# EAGLE design Adafruit_MCP7386x (EAGLE 5.01)
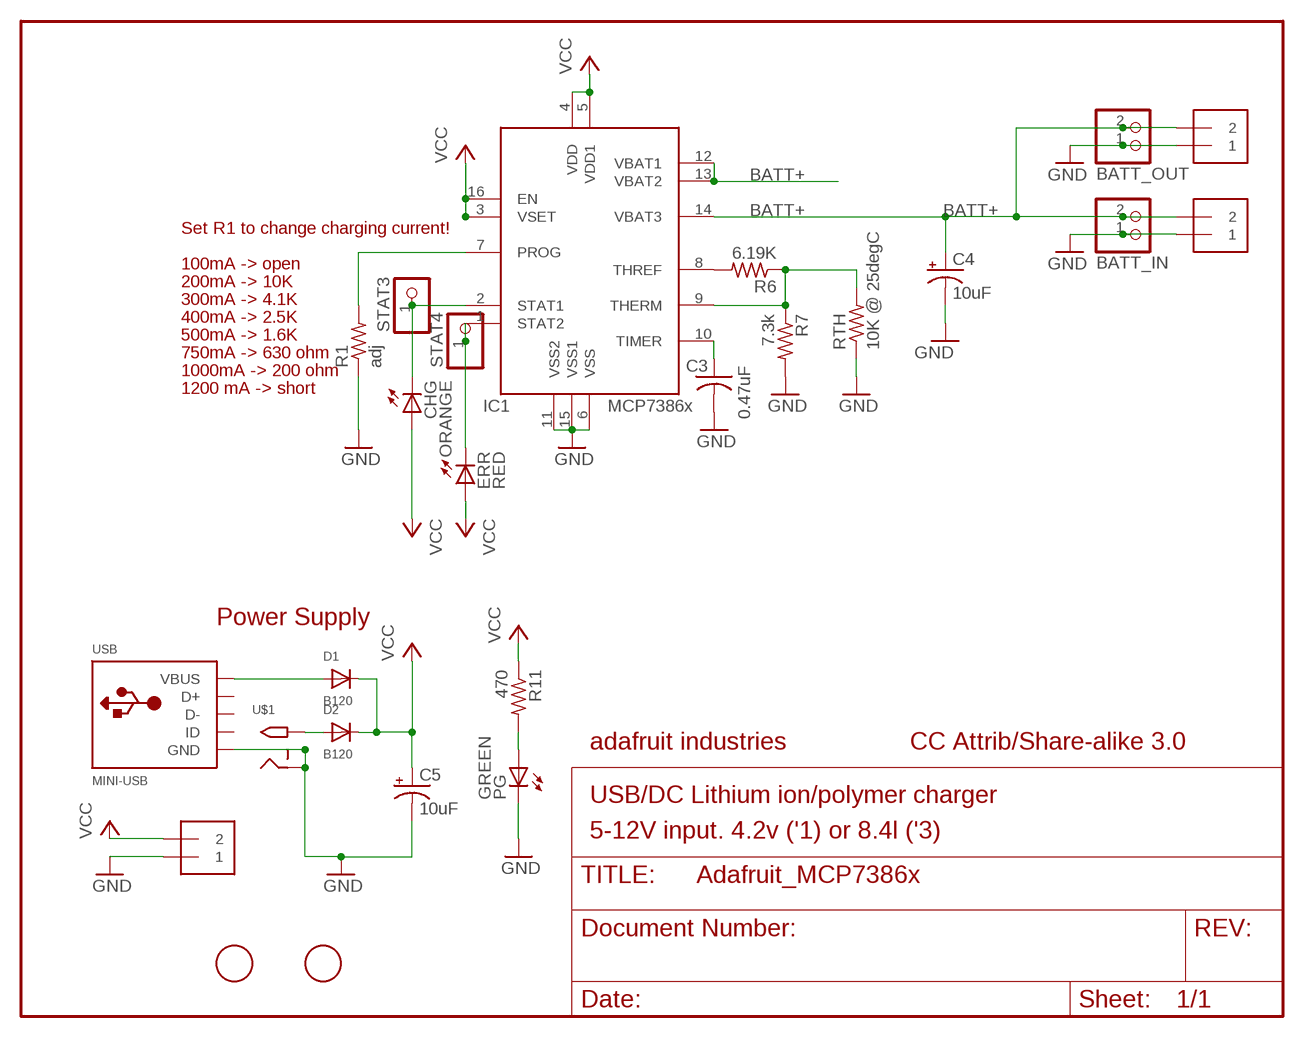
[diagram p0: schematic, sheet 1]

## Parts
BATT_IN  JST_2PIN  [JSTPH2]
BATT_OUT  JST_2PIN  [JSTPH2]
C3  0.47uF  C-USC0805K  [C0805K]
C4  10uF  CPOL-USA/3216-18R  [A/3216-18R]
C5  10uF  CPOL-USA/3216-18R  [A/3216-18R]
CHG  ORANGE  LEDCHIPLED_0805  [CHIPLED_0805]
D1  B120  DIODESMA  [SMADIODE]
D2  B120  DIODESMA  [SMADIODE]
ERR  RED  LEDCHIPLED_0805  [CHIPLED_0805]
IC1  MCP7386XS  [SO16]
IN  1X2-3.5MM  [3.5MMTERM]
OUT  1X2-3.5MM  [3.5MMTERM]
PG  GREEN  LEDCHIPLED_0805  [CHIPLED_0805]
R1  adj  R-US_FLIPFLOP  [0805-THM]
R6  6.19K  R-US_R0805  [R0805]
R7  7.3k  R-US_R0805  [R0805]
R11  470  R-US_R0805  [R0805]
RTH  10K @ 25degC  R-US_FLIPFLOP  [0805-THM]
STAT3  PINHD-1X1  [1X01]
STAT4  PINHD-1X1  [1X01]
U$1  2.1MMJACKSMT  [DCJACK_2MM_SMT]
U$3  FIDUCIAL  [FIDUCIAL_1MM]
U$4  FIDUCIAL  [FIDUCIAL_1MM]
USB  MINI-USB  USBMINIB  [USB-MINIB]
VIN  1X2-3.5MM  [3.5MMTERM]

## Nets
BATT+: BATT_IN.2 BATT_OUT.2 C4.+ IC1.12(VBAT1) IC1.13(VBAT2) IC1.14(VBAT3) IN.2 OUT.2
GND: BATT_IN.1 BATT_OUT.1 C3.2 C4.- C5.- IC1.6(VSS) IC1.11(VSS2) IC1.15(VSS1) IN.1 OUT.1 PG.C R1.1 R7.2 RTH.1 U$1.GND(RING) U$1.GNDBREAK(RING_SW) USB.GND VIN.1
N$4: D1.A USB.VBUS
N$5: IC1.7(PROG) R1.2
N$7: CHG.C IC1.2(STAT1) STAT3.1
N$8: ERR.C IC1.1(STAT2) STAT4.1
N$9: C3.1 IC1.10(TIMER)
N$10: IC1.8(THREF) R6.2
N$11: IC1.9(THERM) R6.1 R7.1 RTH.2
N$16: PG.A R11.2
N$17: D2.A U$1.PWR2(TIP)
VCC: C5.+ CHG.A D1.C D2.C ERR.A IC1.3(VSET) IC1.4(VDD) IC1.5(VDD1) IC1.16(EN) R11.1 VIN.2
Unconnected: USB.D+ USB.D- USB.ID

## Notes on the sheet
- Set R1 to change charging current!
- 100mA -> open
- 200mA -> 10K
- 300mA -> 4.1K
- 400mA -> 2.5K
- 500mA -> 1.6K
- 750mA -> 630 ohm
- 1000mA -> 200 ohm
- 1200 mA -> short
- Power Supply
- adafruit industries | CC Attrib/Share-alike 3.0
- USB/DC Lithium ion/polymer charger
- 5-12V input. 4.2v ('1) or 8.4l ('3)

## Library data of the parts
BATT_IN BATT_OUT = microbuilder:JST_2PIN: JST 2-Pin Right-Angle Connector 4UConnector: 17311
C3 = adafruit:C-US: CAPACITOR, American symbol
C4 C5 = adafruit:CPOL-US: POLARIZED CAPACITOR, American symbol
CHG ERR PG = adafruit:LED: LED OSRAM: - CHIPLED LG R971, LG N971, LY N971, LG Q971, LY Q971, LO R971, LY R971 LH N974, LH R974 LS Q976, LO Q976, LY Q976 LO Q996 - Hyper CHIPLED LW Q18S LB Q993, LB Q99A, LB R99A - SideLED LS A670, LO A670, LY A670, LG A670, LP A670 LB A673, LV A673, LT A673, LW A673 LH A674 LY A675 LS A676, LA A676, LO A676, LY A676, LW A676 LS A679, LY A679, LG A679 - Hyper Micro SIDELED® LS Y876, LA Y876, LO Y876, LY Y876 LT Y87S - SmartLED LW L88C, LW L88S LB L89C, LB L89S, LG L890 LS L89K, LO L89K, LY L89K LS L896, LA L896, LO L896, LY L896 - TOPLED LS T670, LO T670, LY T670, LG T670, LP T670 LSG T670, LSP T670, LSY T670, LOP T670, LYG T670 LG T671, LOG T671, LSG T671 LB T673, LV T673, LT T673, LW T673 LH T674 LS T676, LA T676, LO T676, LY T676, LB T676, LH T676, LSB T676, LW T676 LB T67C, LV T67C, LT T67C, LS T67K, LO T67K, LY T67K, LW E67C LS E67B, LA E67B, LO E67B, LY E67B, LB E67C, LV E67C, LT E67C LW T67C LS T679, LY T679, LG T679 LS T770, LO T770, LY T770, LG T770, LP T770 LB T773, LV T773, LT T773, LW T773 LH T774 LS E675, LA E675, LY E675, LS T675 LS T776, LA T776, LO T776, LY T776, LB T776 LHGB T686 LT T68C, LB T68C - Hyper Mini TOPLED® LB M676 - Mini TOPLED Santana® LG M470 LS M47K, LO M47K, LY M47K Source: http://www.osram.convergy.de/
D1 D2 = microbuilder:DIODE: Diode SMADIODE - SMA Surface Mount Package 20V 1A Schottky Diode Digikey: 641-1014-6-ND DO-1N4148 - Through Hole Small Current Diode SOD-323 10V 570mA (.38mV Vf, 3ns) Schottky Diode - Digikey: ZLLS410CT-ND SOD-523 30V 30mA Schottky Diode (RB751S-40TE61) - Digikey: RB751S-40TE61CT-ND SOT23-R/W - SOT23 Package (R = Solder Paste/Reflow Ovens, W = Hand-Soldering) BAT54Film 40V 300mA - Digikey: 497-7162-1-ND
IC1 = adafruit:MCP7386X: MCP7386x 4.1, 4.2, 8.2, 8.4 LiPoly battery charger chip family, with wide DC input, thermal cutoff, adjustable curret, and indicator LEDs
IN OUT VIN = adafruit:1X2: 3.5mm Terminal block http://www.ladyada.net/library/pcb/eaglelibrary.html
R1 R6 R7 R11 RTH = adafruit:R-US_: RESISTOR, American symbol
STAT3 STAT4 = adafruit:PINHD-1X1: Pin header 1x1 for 0.1" spacing With round pins
U$1 = adafruit:2.1MMJACK: 2.1mm x 5.5mm THM DC jack with internal switch. Digikey part #PJ-102A, 4UCON part #05537 2.1mm x 5.5mm SMT DC jack with internal switch. Digikey part #PJ-002A-SMT, 4UCON part #03267 By microbuilder.eu & adafruit.com
U$3 U$4 = adafruit:FIDUCIAL: For use by pick and place machines to calibrate the vision/machine, 1mm By microbuilder.eu
USB = adafruit:USB: USB Connectors USBMINIB - Surface Mount Female Mini-B USB Connector 4UConnector: 06564 By microbuilder.eu Thru-hole RA Female Mini-B USB Connector 4UConnector: 18732 By ladyada.net

## Board
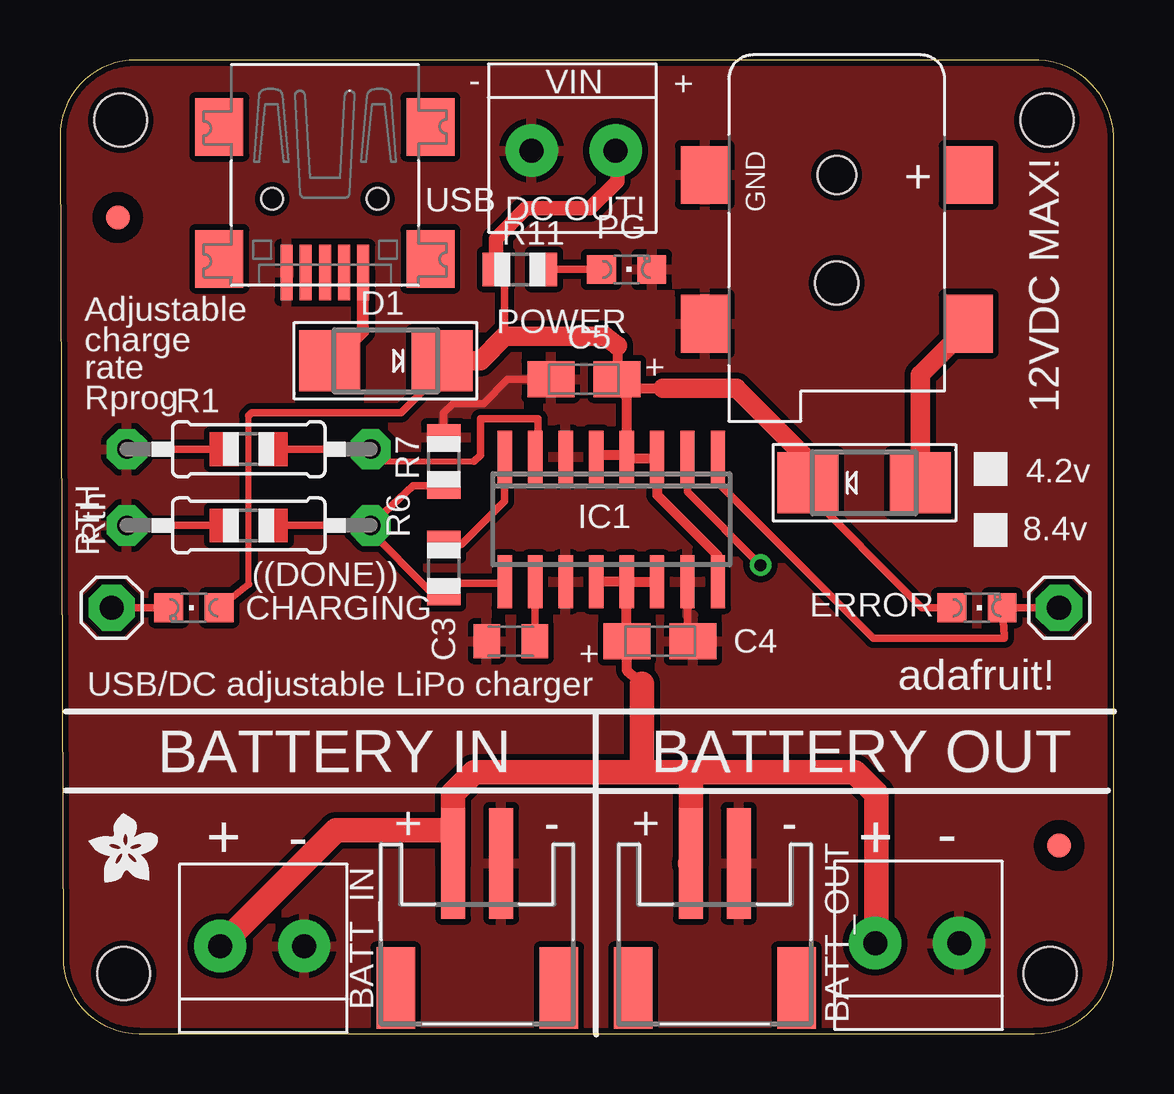
[diagram p1: board, top side]
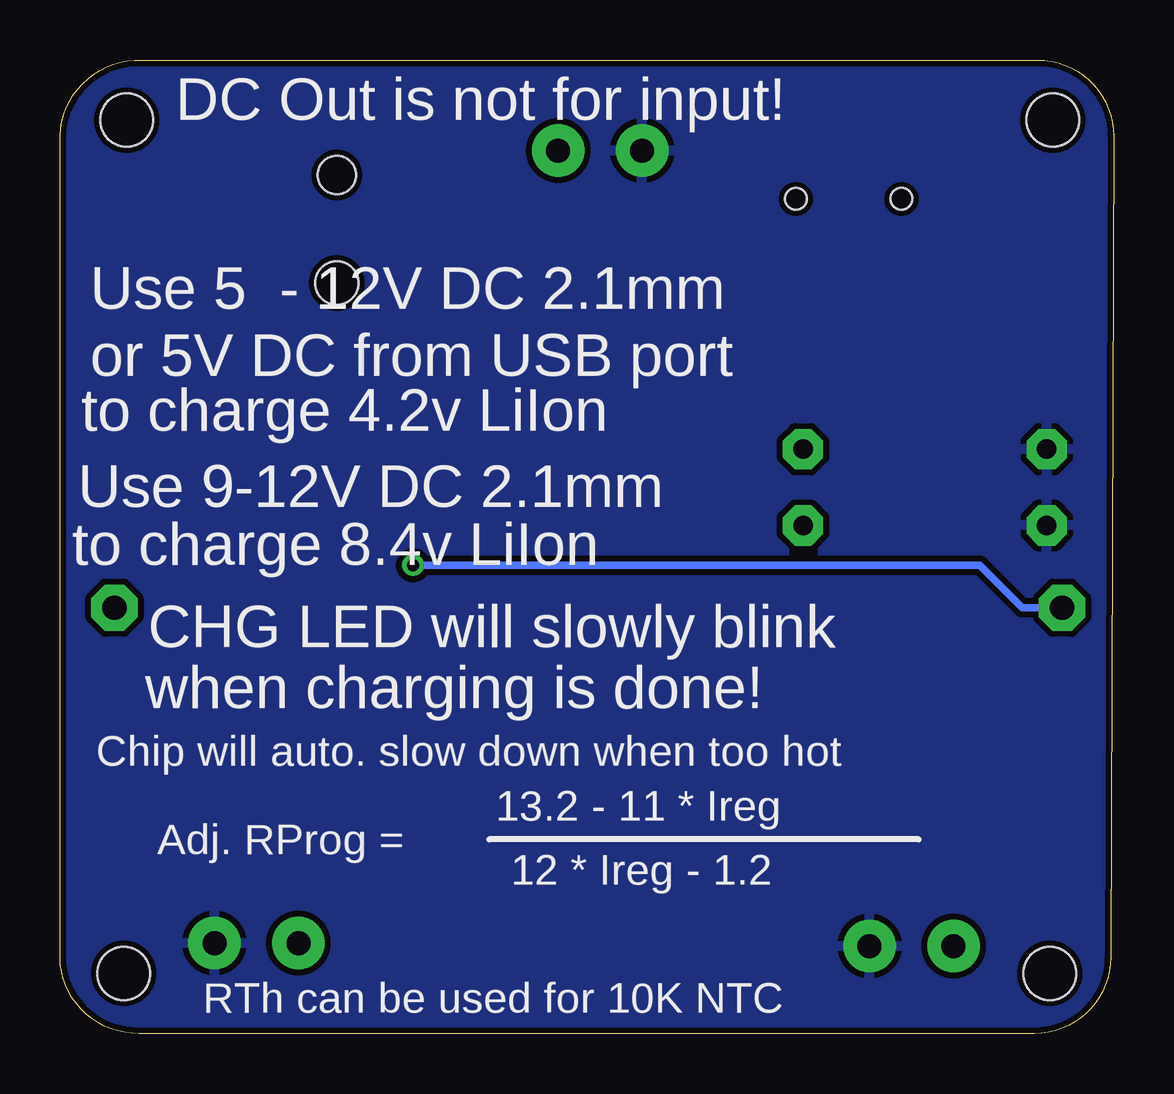
[diagram p2: board, bottom side, seen from below]

Size 43.92 x 40.56 mm. Coordinates in mm from the lower left corner, seen from the top.
Outline: 40.62,0 arc90 43.92,3.18 43.92,37.39 arc90 40.49,40.56 3.17,40.56 arc90 0,37.39 0.13,3.18 arc90 3.3,0 40.62,0
Copper layers (1*16): Top 0.035mm / dielectric 1.5mm / Bottom 0.035mm
Design rules "default *": minimum track width 10mil, minimum drill 19mil, track to track 10mil, track to pad 10mil, pad to pad 10mil, via to via 10mil, smd to smd 0mil, copper to edge 10mil, drill to drill 8mil, minimum pad ring 10mil, minimum via ring 8mil, stop-mask expansion 4mil, vias tented up to drill 0mil, thermal gap 10mil
Holes 2.2 mm at 2.66,2.5 41.27,2.5 2.53,38.06 41.14,38.06

### Footprints (pad centres in the part's own frame; a part is rotated, then mirrored left to right if it is on the bottom)
JSTPH2 = smd 1 x 4.6: 1 -1,-3.7; 2 1,-3.7 | smd 1.6 x 3.4: NC1 -3.4,1.5; NC2 3.4,1.5
C0805K = smd 1.1 x 1.4: 1 -1,0; 2 1,0
A/3216-18R = smd 1.95 x 1.5: + 1.375,0; - -1.375,0
CHIPLED_0805 = smd 1.2 x 1.2: A 0,-1.05; C 0,1.05
SMADIODE = smd 2.54 x 2.54: A 2.349,0; C -2.349,0
SO16 = smd 0.6 x 2.2: 1 -4.445,-2.6; 2 -3.175,-2.6; 3 -1.905,-2.6; 4 -0.635,-2.6; 5 0.635,-2.6; 6 1.905,-2.6; 7 3.175,-2.6; 8 4.445,-2.6; 9 4.445,2.6; 10 3.175,2.6; 11 1.905,2.6; 12 0.635,2.6; 13 -0.635,2.6; 14 -1.905,2.6; 15 -3.175,2.6; 16 -4.445,2.6
3.5MMTERM = drill 1 pad 2.184: 1 1.8,0; 2 -1.7,0
0805-THM = drill 0.813 pad 1.676 octagon: 1 -5.08,0; 2 5.08,0
R0805 = smd 1.1 x 1.4: 1 -1,0; 2 1,0
1X01 = drill 1.016 pad 1.93 octagon: 1 0,0
DCJACK_2MM_SMT = smd 2.4 x 2: GND 0,-5.5; GNDBREAK 6.2,-5.5; PWR1 0,5.5; PWR2 6.2,5.5 | hole 1.6: 0,0 | hole 1.8: 4.5,0
FIDUCIAL_1MM = smd 1 x 1: 1 0,0
USB-MINIB = smd 0.5 x 2.308: D+ 0,4.064; D- -0.8,4.064; GND 1.6,4.064; ID 0.8,4.064; VBUS -1.6,4.064 | smd 2 x 2.4: GND1 -4.4,-2; GND2 -4.4,3.5; GND3 4.4,3.5; GND4 4.4,-2 | hole 0.9: -2.2,1; 2.2,1

### Placement (x,y rotation side)
BATT_IN  17.39,3.39 180 top
BATT_OUT  27.3,3.39 180 top
C3  18.79,16.34 180 top
C4  25.01,16.34 180 top
C5  21.84,27.27 0 top
CHG  5.58,17.74 90 top
D1  13.58,28.03 180 top
D2  33.52,22.95 0 top
ERR  38.22,17.74 270 top
IC1  22.98,21.43 180 top
IN  8.38,3.65 0 top
OUT  35.68,3.77 0 top
PG  23.62,31.84 270 top
R1  7.87,24.35 0 top
R6  16,19.39 90 top
R7  16,23.84 90 top
R11  19.17,31.84 0 top
RTH  7.87,21.17 0 top
STAT3  2.15,17.74 0 top
STAT4  41.65,17.74 0 top
U$1  32.38,35.78 270 top
U$2  [ADAFRUIT200MIL]  2.53,7.71 0 top
U$3  41.65,7.84 90 top
U$4  2.41,34 90 top
USB  11.04,35.78 180 top
VIN  21.46,36.79 180 top

### Tracks (layer width: path | path; a pad name or v marks a point on that pad's centre or on a via)
BATT+
  Top 0.406: IC1.13 IC1.14 | IC1.13 IC1.12 22.35,19.01 | IC1.13 23.62,16.85 24.25,16.22 C4.+ 23.64,15.1 24.25,14.57
  Top 1.016: 26.27,7.09 BATT_OUT.2 26.3,10.88 26.41,10.88 | 24.25,10.88 24.25,14.57 | 16.39,8.47 BATT_IN.2 | 16.39,8.47 16.39,10.01 17.27,10.88 24.25,10.88 | IN.2 11.5,8.47 16.39,8.47 | 26.41,10.88 33.14,10.88 34.03,9.99 34.03,3.82 OUT.2 | 24.25,10.88 26.41,10.88
GND
  Top 0.305: C5.- 18.66,27.27 17.65,26.25 16.38,26.25 16,25.87 R7.2 | C4.- 26.16,16.45 IC1.15
  pour Top: -0.13,-0.17 -0.01,40.35 44.45,40.6 44.57,-0.04
  pour Bottom: -0.01,-0.04 -0.39,41.11 44.45,40.6 44.57,-0.04
N$4
  Top 0.508: D1.A 11.23,27.96 11.3,27.9 12.64,29.25 USB.VBUS
N$5
  Top 0.254: 13.46,23.84 17.27,23.84
  Top 0.305: R1.2 13.46,23.84 | 17.27,23.84 17.52,24.09 17.52,25.62 19.93,25.62 19.93,24.15 IC1.7
N$7  (via drill 0.5)
  Top 0.305: STAT3.1 CHG.C | IC1.2 26.16,22.57 v29.2,19.52
  Bottom 0.305: STAT3.1 3.8,17.74 5.58,19.52 v29.2,19.52
N$8
  Top 0.305: IC1.1 27.43,22.95 33.9,16.47 39.37,16.47 39.37,16.6 ERR.C STAT4.1
N$9
  Top 0.305: 19.81,18.88 IC1.10 19.81,16.84 C3.1
N$10
  Top 0.305: R6.2 16.74,20.39 18.54,22.19 IC1.8
N$11
  Top 0.305: R7.1 15.98,22.82 14.73,22.82 RTH.2 12.82,21.04 15.47,18.39 R6.1 16.36,18.76 18.54,18.76 IC1.9
N$16
  Top 0.305: 22.6,31.84 PG.A R11.2
N$17
  Top 0.813: U$1.PWR2 37.88,29.46 35.87,27.46 D2.A
VCC
  Top 0.254: 7.87,18.72 7.87,25.74
  Top 0.305: R11.1 18.54,31.47 18.54,29.04 | D2.C 30.98,22.95 30.86,22.82 35.94,17.74 ERR.A | CHG.A 7.87,18.72 | 7.87,25.74 8,25.87 14.22,25.87 15.74,27.39 15.74,27.9 15.81,27.9 D1.C
  Top 0.406: IC1.4 23.62,26.48 C5.+ 23.24,27.27 | IC1.5 22.41,24.09 23.55,24.09 IC1.4 | IC1.3 24.83,23.96 23.68,23.96 IC1.4 | IC1.16 27.43,19.9 24.89,22.44 IC1.3 | IC1.3 24.89,24.09 | 25.14,26.89 23.11,26.89 23.24,27.27 | 23.24,28.66 23.24,27.27
  Top 0.61: R11.1 18.17,33.12 19.43,34.38 22.09,34.38 23.24,35.52 23.24,36.67 23.16,36.74 VIN.2
  Top 0.813: D2.C 31.17,23.9 28.19,26.89 25.14,26.89 | D1.C 17.52,28.03 18.54,29.04 22.73,29.04 23.24,28.66

### Text on the board
tPlace: - | + | DC OUT! | Adjustable | POWER | charge | rate | Rprog | 12VDC MAX! | Rth | 4.2v | 8.4v | ((DONE)) | CHARGING | ERROR | USB/DC adjustable LiPo charger | adafruit! | BATTERY IN | BATTERY OUT | + | - | + | -
bPlace: DC Out is not for input! | Use 5 - 12V DC 2.1mm | or 5V DC from USB port | to charge 4.2v LiIon | Use 9-12V DC 2.1mm | to charge 8.4v LiIon | CHG LED will slowly blink | when charging is done! | Chip will auto. slow down when too hot | 13.2 - 11 * Ireg | Adj. RProg = | 12 * Ireg - 1.2 | RTh can be used for 10K NTC